# EAGLE design SparkFun_FM_Tuner_Basic_Breakout (EAGLE 7.2.0)
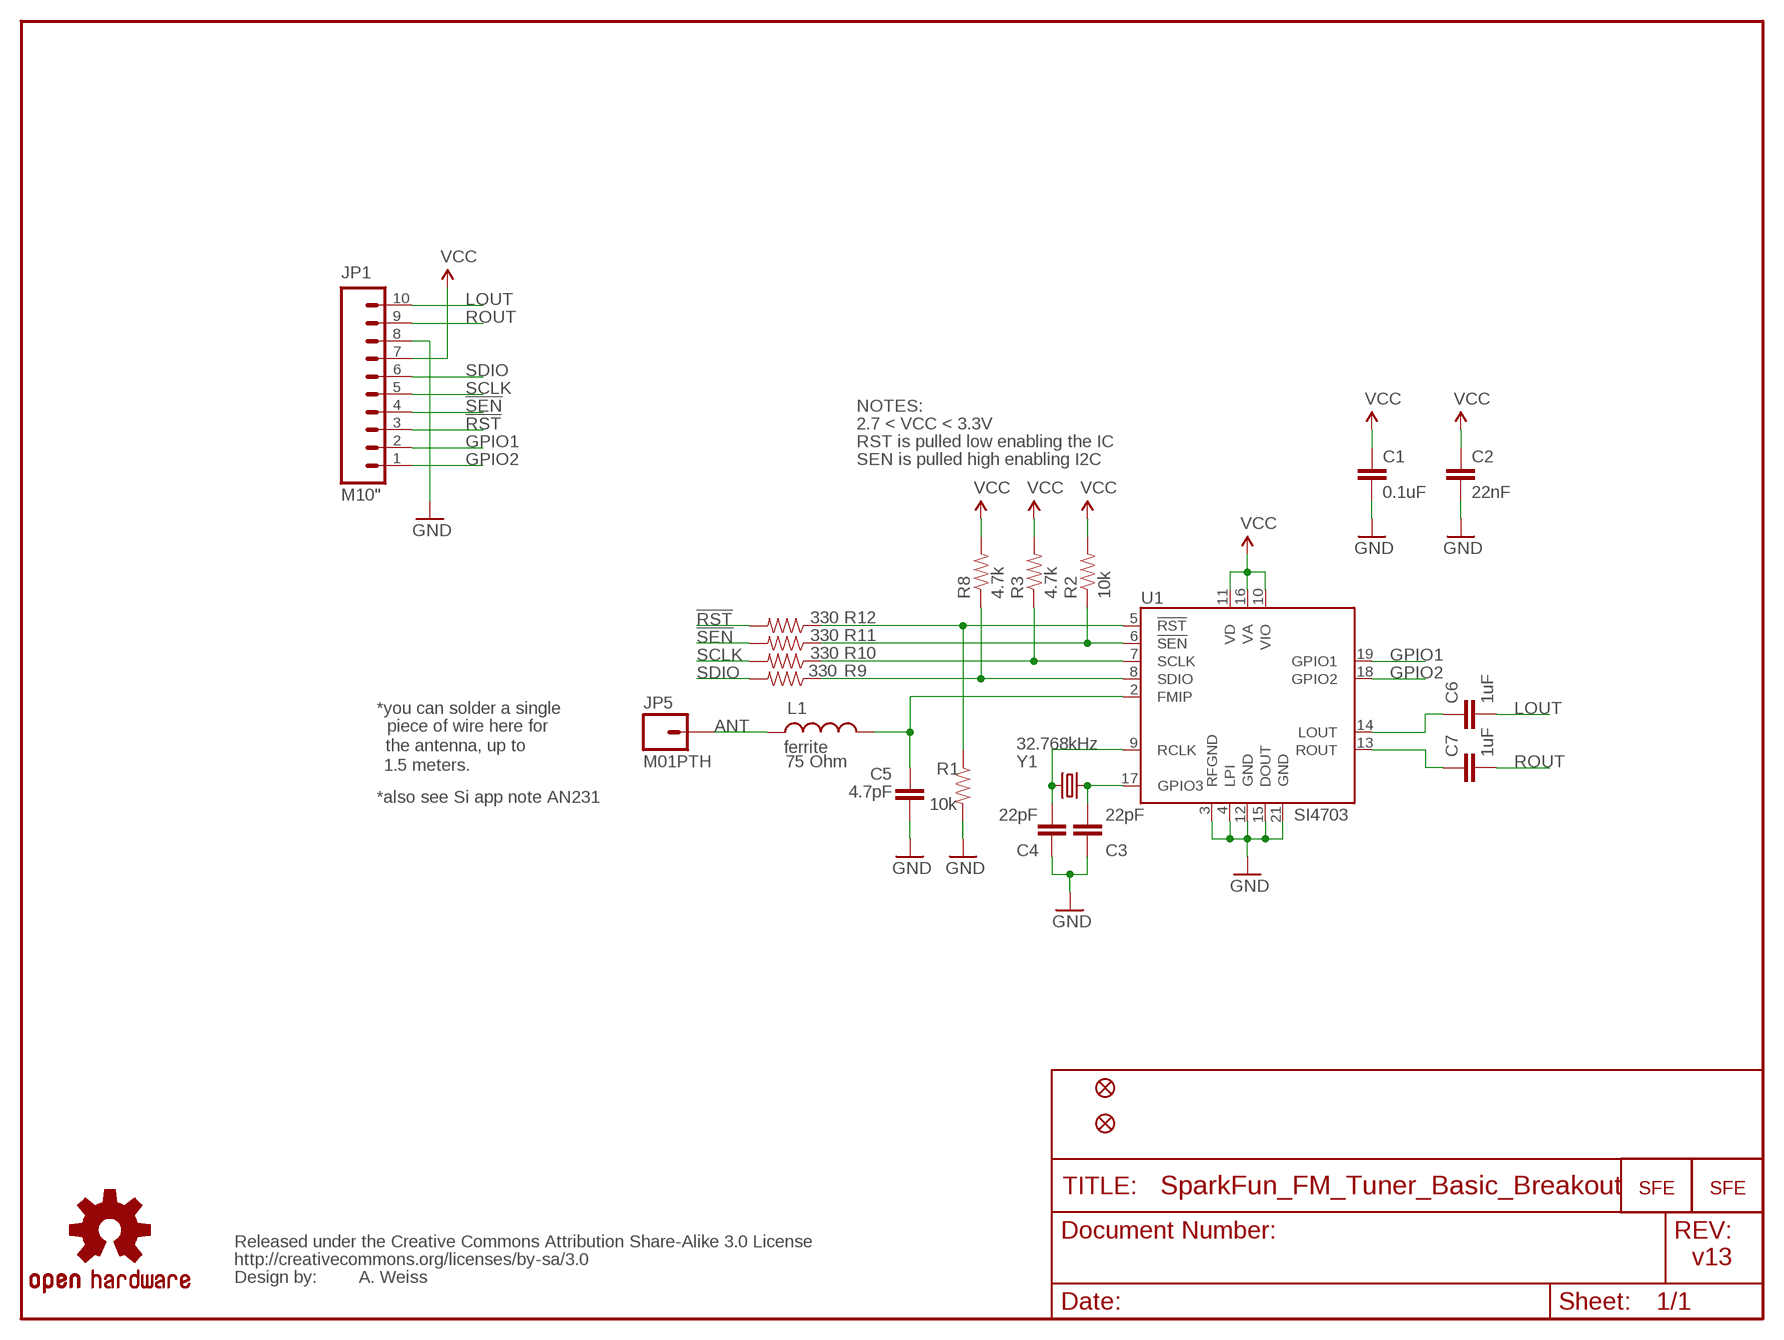
[diagram p0: schematic, sheet 1]

## Parts
C1  0.1uF  CAP0402-CAP  [0402-CAP]
C2  22nF  CAP0402-CAP  [0402-CAP]
C3  22pF  CAP0402-CAP  [0402-CAP]
C4  22pF  CAP0402-CAP  [0402-CAP]
C5  4.7pF  CAP0402-CAP  [0402-CAP]
C6  1uF  CAP0402-CAP  [0402-CAP]
C7  1uF  CAP0402-CAP  [0402-CAP]
JP1  M10"  [1X10]
JP2  LOGO-SFENW2  [SFE-NEW-WEB]
JP3  LOGO-SFESK  [SFE-LOGO-FLAME]
JP4  FIDUCIALUFIDUCIAL  [MICRO-FIDUCIAL]
JP5  M01PTH  [1X01]
JP6  FIDUCIALUFIDUCIAL  [MICRO-FIDUCIAL]
L1  ferrite  INDUCTOR0402  [C0402]
R1  10k  RESISTOR0402-RES  [0402-RES]
R2  10k  RESISTOR0402-RES  [0402-RES]
R3  4.7k  RESISTOR0402-RES  [0402-RES]
R8  4.7k  RESISTOR0402-RES  [0402-RES]
R9  330  RESISTOR0402-RES  [0402-RES]
R10  330  RESISTOR0402-RES  [0402-RES]
R11  330  RESISTOR0402-RES  [0402-RES]
R12  330  RESISTOR0402-RES  [0402-RES]
U1  SI4703  SPARKFUN_SI470X  [SPARKFUN_SI470X]
U$1  CREATIVE_COMMONS  [CREATIVE_COMMONS]
U$3  OSHW-LOGOS  [OSHW-LOGO-S]
Y1  32.768kHz  CRYSTAL32-SMD  [CRYSTAL-32KHZ-SMD]

## Nets
3.3V: C1.1 C2.1 JP1.7 R2.2 R3.2 R8.2 U1.10(VIO) U1.11(VD) U1.16(VA) ; supply symbol labelled VCC
!RST: JP1.3 R12.2
!RST-L: R1.1 R12.1 U1.5(!RST)
!SEN: JP1.4 R11.2
!SEN-L: R2.1 R11.1 U1.6(!SEN)
ANT: JP5.1 L1.1
GND: C1.2 C2.2 C3.1 C4.1 C5.2 JP1.8 R1.2 U1.3(RFGND) U1.4(LPI) U1.12(GND) U1.15(DOUT) U1.21(GND)
GPIO1: JP1.2 U1.19(GPIO1)
GPIO2: JP1.1 U1.18(GPIO2)
LOUT: C6.2 JP1.10
N$1: C4.2 U1.9(RCLK) Y1.X2
N$2: C3.2 U1.17(GPIO3) Y1.X1
N$3: C5.1 L1.2 U1.2(FMIP)
N$13: C6.1 U1.14(LOUT)
N$14: C7.1 U1.13(ROUT)
ROUT: C7.2 JP1.9
SCLK: JP1.5 R10.2
SCLK-L: R3.1 R10.1 U1.7(SCLK)
SDIO: JP1.6 R9.2
SDIO-L: R8.1 R9.1 U1.8(SDIO)

## Notes on the sheet
- NOTES:
- 2.7 < VCC < 3.3V
- RST is pulled low enabling the IC
- SEN is pulled high enabling I2C
- *you can solder a single
- piece of wire here for
- the antenna, up to
- 1.5 meters.
- *also see Si app note AN231
- v13
- A. Weiss

## Library data of the parts
C1-C7 = SparkFun:CAP: Capacitor Standard 0603 ceramic capacitor, and 0.1" leaded capacitor.
JP1 = SparkFun-Connectors:M10: Header 10 Standard 10-pin 0.1" header. Use with straight break away headers (SKU : PRT-00116), right angle break away headers (PRT-00553), swiss pins (PRT-00743), machine pins (PRT-00117), and female headers (PRT-00115).
JP2 JP3 = SparkFun:LOGO-SFE: Spark Fun Electronics PCB Logo This is the standard Spark Fun Electronics PCB logo.
JP4 JP6 = SparkFun:FIDUCIAL: Fiducial Alignment Points Various fiducial points for machine vision alignment.
JP5 = SparkFun-Connectors:M01: Header 1 Standard 1-pin 0.1" header. Use with straight break away headers (SKU : PRT-00116), right angle break away headers (PRT-00553), swiss pins (PRT-00743), machine pins (PRT-00117), and female headers (PRT-00115).
L1 = SparkFun-Passives:INDUCTOR: Inductors Basic Inductor/Choke - 0603 and 1206. Footprints are not proven and vary greatly between part numbers.; RESISTANCE: 75 Ohm
R1-R3 R8-R12 = SparkFun:RESISTOR: Resistor Basic schematic elements and footprints for 0603, 1206, and PTH 1/10th watt (small) resistors.
U1 = FM-Meter-Driver-v11:SPARKFUN_SI470X: Description: This is a powerful FM receiver IC. Tested with Si4703. You really only need SEN, RST, SCLK, and SDIO to get a full FM radio working. Antenna comes from headphone jack. See breakout board on SparkFun website for more information.
U$1 = SparkFun-Aesthetics:CREATIVE_COMMONS: Creative Commons License summary
U$3 = SparkFun:OSHW-LOGO: Open Source Hardware Logo This logo indicates the piece of hardware it is found on incorporates a OSHW license and/or adheres to the definition of open source hardware found here: http://freedomdefined.org/OSHW
Y1 = SparkFun:CRYSTAL: Crystals Various standard crystals. Proven footprints. Spark Fun Electronics SKU : COM-00534

## Board
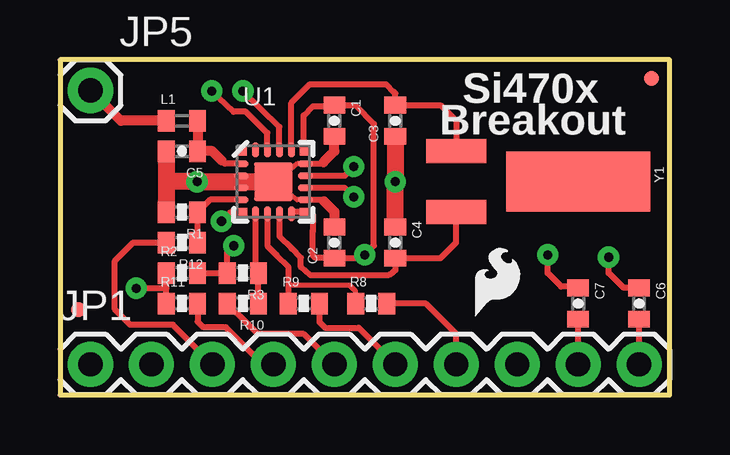
[diagram p1: board, top side]
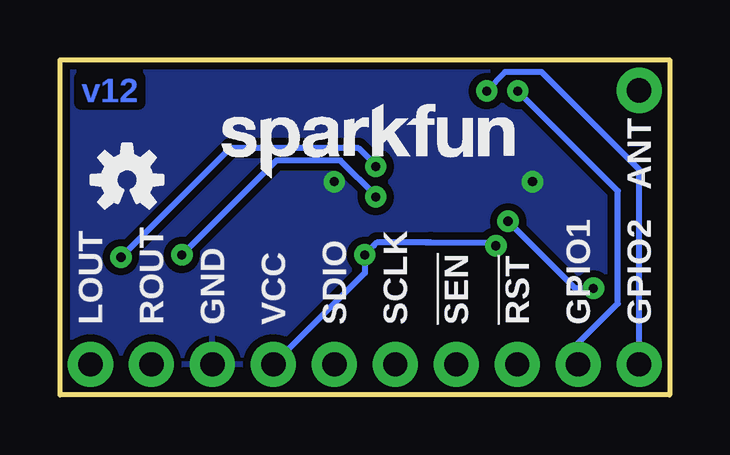
[diagram p2: board, bottom side, seen from below]

Size 25.4 x 13.97 mm. Coordinates in mm from the lower left corner, seen from the top.
Outline: 0,0 25.4,0 25.4,13.97 0,13.97 0,0
Copper layers (1*16): Top 0.035mm / dielectric 1.5mm / Bottom 0.035mm
Design rules "default": minimum track width 8mil, minimum drill 15mil, track to track 8mil, track to pad 8mil, pad to pad 8mil, via to via 8mil, smd to smd 8mil, copper to edge 10mil, drill to drill 8mil, minimum pad ring 12mil, minimum via ring 10mil, stop-mask expansion 4mil, vias tented up to drill 20mil, thermal gap 10mil

### Footprints (pad centres in the part's own frame; a part is rotated, then mirrored left to right if it is on the bottom)
0402-CAP = smd 0.7 x 0.9: 1 -0.65,0; 2 0.65,0
1X10 = drill 1.016 pad 1.88: 1 0,0; 2 2.54,0; 3 5.08,0; 4 7.62,0; 5 10.16,0; 6 12.7,0; 7 15.24,0; 8 17.78,0; 9 20.32,0; 10 22.86,0
MICRO-FIDUCIAL = smd 0.635 x 0.635: 1 0,0
1X01 = drill 1.016 pad 1.88: 1 0,0
C0402 = smd 0.7 x 0.9: 1 -0.65,0; 2 0.65,0
0402-RES = smd 0.7 x 0.9: 1 -0.65,0; 2 0.65,0
SPARKFUN_SI470X = smd 0.34 x 0.34: 1 -1.275,1.265; 6 -1.265,-1.265; 11 1.265,-1.265; 16 1.265,1.265 | smd 0.61 x 0.28: 2 -1.335,0.75; 3 -1.335,0.25; 4 -1.335,-0.25; 5 -1.335,-0.75; 12 1.335,-0.75; 13 1.335,-0.25; 14 1.335,0.25; 15 1.335,0.75 | smd 0.28 x 0.61: 7 -0.75,-1.335; 8 -0.25,-1.335; 9 0.25,-1.335; 10 0.75,-1.335; 17 0.75,1.335; 18 0.25,1.335; 19 -0.25,1.335; 20 -0.75,1.335 | smd 1.6 x 1.6: 21 0,0
CRYSTAL-32KHZ-SMD = smd 2.5 x 6: SHEILD 0,5.08 | smd 1 x 2.5: X1 -1.27,0; X2 1.27,0

### Placement (x,y rotation side)
C1  11.43,11.43 270 top
C2  11.43,6.35 90 top
C3  13.97,11.43 90 top
C4  13.97,6.35 270 top
C5  5.08,10.16 180 top
C6  24.13,3.81 270 top
C7  21.59,3.81 270 top
JP1  1.27,1.27 0 top
JP2  18.67,9.02 0 bottom
JP3  17.3,3.3 0 top
JP4  0.76,3.56 0 top
JP5  1.27,12.7 0 top
JP6  24.64,13.21 0 top
L1  5.08,11.43 0 top
R1  5.08,7.62 180 top
R2  5.08,5.08 0 top
R3  7.62,5.08 180 top
R8  12.97,3.81 0 top
R9  10.16,3.81 0 top
R10  7.62,3.81 180 top
R11  5.08,3.81 0 top
R12  5.08,6.35 180 top
U1  8.89,8.89 0 top
U$1  10.16,2.54 0 top
U$3  22.61,8.97 0 bottom
Y1  16.51,8.89 270 top

### Tracks (layer width: path | path; a pad name or v marks a point on that pad's centre or on a via)
3.3V  (via drill 0.38)
  Top 0.254: 11.45,12.06 C1.1 | 11.3,5.71 11.43,5.71 C2.1 11.45,5.71 | JP1.7 16.51,2.54 15.24,3.81 R8.2 | R2.2 R3.2 6.97,5.95 v7.24,6.22 | U1.16 10.15,11.65 10.54,12.04 11.46,12.04 11.46,12.05 C1.1 | U1.11 | 11.45,5.71 10.64,5.71 10.54,5.82 10.54,6.81 | 10.54,6.81 10.54,6.88 | 11.45,5.71 12.57,5.71 v12.7,5.84 12.95,6.1 13.08,6.22 13.08,11.3 12.32,12.06 11.56,12.06 11.45,12.06 | U1.11 9.71,7.62 U1.10 | U1.11 10.43,7.62 10.54,7.52 10.54,6.81 | 11.45,12.06 C1.1
  Bottom 0.254: 12.32,6.22 v12.7,5.84 | v12.7,5.84 12.7,5.08 JP1.7 | 10.16,6.35 9.98,6.35 | 9.98,6.35 7.37,6.35 v7.24,6.22 | 10.16,6.35 12.19,6.35 v12.7,5.84 | 9.96,6.38 9.98,6.35 | 9.98,6.35 10.16,6.35
!RST
  Top 0.254: JP1.3 4.7,2.92 2.92,2.92 2.29,3.56 2.29,5.59 3.05,6.35 R12.2
!RST-L
  Top 0.254: R12.1 R1.1 6.25,8.14 U1.5
!SEN
  Top 0.254: JP1.4 8.46,1.27 6.91,2.82 5.97,2.82 5.74,3.05 5.73,3.06 R11.2
!SEN-L  (via drill 0.38)
  Top 0.254: R2.1 R11.1 4.43,4.45 v3.17,4.45 | U1.6 7.12,7.62 v6.73,7.24
  Bottom 0.254: v3.17,4.45 3.94,4.45 v6.73,7.24
ANT
  Top 0.406: L1.1 2.54,11.43 JP5.1
GND  (via drill 0.38)
  Top 0.203: U1.15 9.89,9.64 9.45,9.27 9.27,9.27 U1.21 | U1.12 9.87,8.14 9.53,8.41 9.37,8.41 U1.21 | U1.4 7.55,8.88 7.57,8.89 | U1.21 8.87,8.89 8.64,8.66 8.66,8.66 U1.21
  Top 0.254: U1.15 10.91,9.64 10.97,9.7 | 9.14,8.89 U1.21 arc-90 8.64,8.64 | U1.12 10.91,8.14 10.94,8.14 11,8.08 | 4.43,7.63 4.45,7.62 | U1.4 U1.3 arc-90 7.3,8.89
  Top 0.406: C1.2 11.43,10.16 10.97,9.7 | C2.2 11.43,7.62 11.43,7.64 11,8.08
  Top 0.711: C4.1 v13.97,8.89 C3.1 | C5.2 4.43,8.89 | 4.43,8.89 4.43,7.63 | 4.43,8.89 v5.71,8.89 7.3,8.89 | 7.57,8.89 U1.21 | R1.2 4.45,7.62
  pour Bottom (isolate 0.305): 0,0 0,13.97 25.4,13.97 25.4,0
GPIO1  (via drill 0.38)
  Top 0.254: U1.19 8.64,10.92 7.75,11.81 7.24,11.81 v6.33,12.68
  Bottom 0.254: JP1.2 3.81,2.16 2.16,3.81 2.16,8.51 v6.33,12.68 | v6.33,12.68 6.35,12.7 v6.33,12.68
GPIO2  (via drill 0.38)
  Top 0.254: U1.18 9.14,11.18 v7.62,12.68
  Bottom 0.254: JP1.1 1.27,9.4 5.33,13.46 5.38,13.46 6.81,13.46 6.86,13.46 v7.62,12.68
LOUT
  Top 0.254: JP1.10 C6.2
N$1
  Top 0.254: U1.9 9.14,7.12 9.14,6.61 9.65,6.1 10.03,5.71 10.03,5.33 10.41,5 13.72,5 13.84,5.08 13.97,5.21 C4.2 15.86,5.7 16.51,6.35 Y1.X2
N$2
  Top 0.254: U1.17 9.64,12.18 10.41,12.95 13.59,12.95 13.91,12.64 | 13.91,12.64 13.97,12.57 | 13.97,12.57 C3.2 15.86,12.08 16.51,11.43 Y1.X1 | 13.97,12.57 13.91,12.64
N$3
  Top 0.254: U1.2 6.87,9.64 6.73,9.78
  Top 0.406: L1.2 C5.1 6.35,10.16 6.73,9.78
N$13  (via drill 0.38)
  Top 0.254: U1.14 11.86,9.14 v12.24,9.53 | C6.1 23.48,4.46 22.86,5.08 v22.86,5.74
  Bottom 0.254: v22.86,5.74 20.57,8.03 18.31,10.29 12.95,10.29 12.24,9.58 v12.24,9.53
N$14  (via drill 0.38)
  Top 0.254: U1.13 11.86,8.64 v12.24,8.26 | C7.1 21.59,4.52 | 21.59,4.52 21.61,4.52 | 21.59,4.52 20.88,4.52 20.32,5.08 20.32,5.82 | 20.32,5.82 v20.32,5.84 20.32,5.82
  Bottom 0.254: v12.24,8.26 12.24,8.31 13.72,9.78 16.38,9.78 v20.32,5.84
ROUT
  Top 0.254: JP1.9 C7.2
SCLK
  Top 0.254: JP1.5 10.16,2.54 8.24,2.54 R10.2
SCLK-L
  Top 0.254: U1.7 8.14,5.32 8.26,5.21 8.27,5.19 R3.1 R10.1
SDIO
  Top 0.254: R9.2 10.81,3.03 11.05,2.79 12.45,2.79 JP1.6
SDIO-L
  Top 0.203: R8.1 12.32,4.32 12.06,4.57 9.65,4.57 9.53,4.57
  Top 0.254: U1.8 8.64,6.22 9.02,5.84 9.53,5.33 9.53,4.57 9.53,3.83 R9.1

### Text on the board
Bottom: v12
tPlace: Si470x | Breakout
bPlace: ANT | GPIO2 | GPIO1 | !RST | !SEN | SCLK | SDIO | VCC | GND | ROUT | LOUT